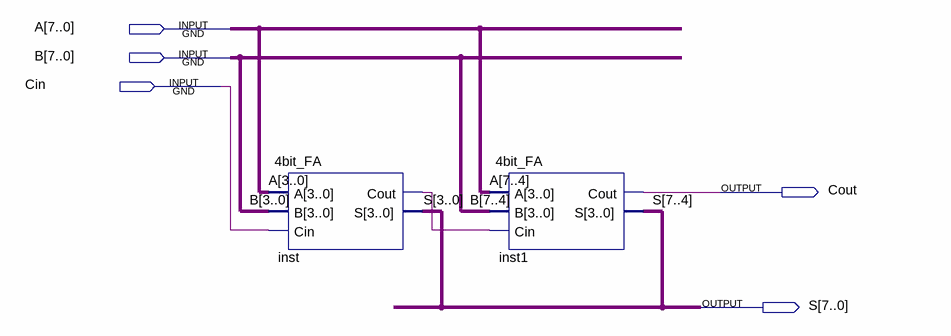
[diagram p0: schematic sheet]
// Quartus schematic 8bit_FA.bdf as structural Verilog: 2 symbols, 5 pins
module \8bit_FA  (
  input  [7:0] A,
  input  [7:0] B,
  input  Cin,
  output Cout,
  output [7:0] S
);

  wire inst_cout;

  \4bit_FA  inst (.A(A[3:0]), .B(B[3:0]), .Cin(Cin), .Cout(inst_cout), .S(S[3:0]));
  \4bit_FA  inst1 (.A(A[7:4]), .B(B[7:4]), .Cin(inst_cout), .Cout(Cout), .S(S[7:4]));
endmodule
